# EAGLE design Board_Schamatic04 (EAGLE 9.6.2)
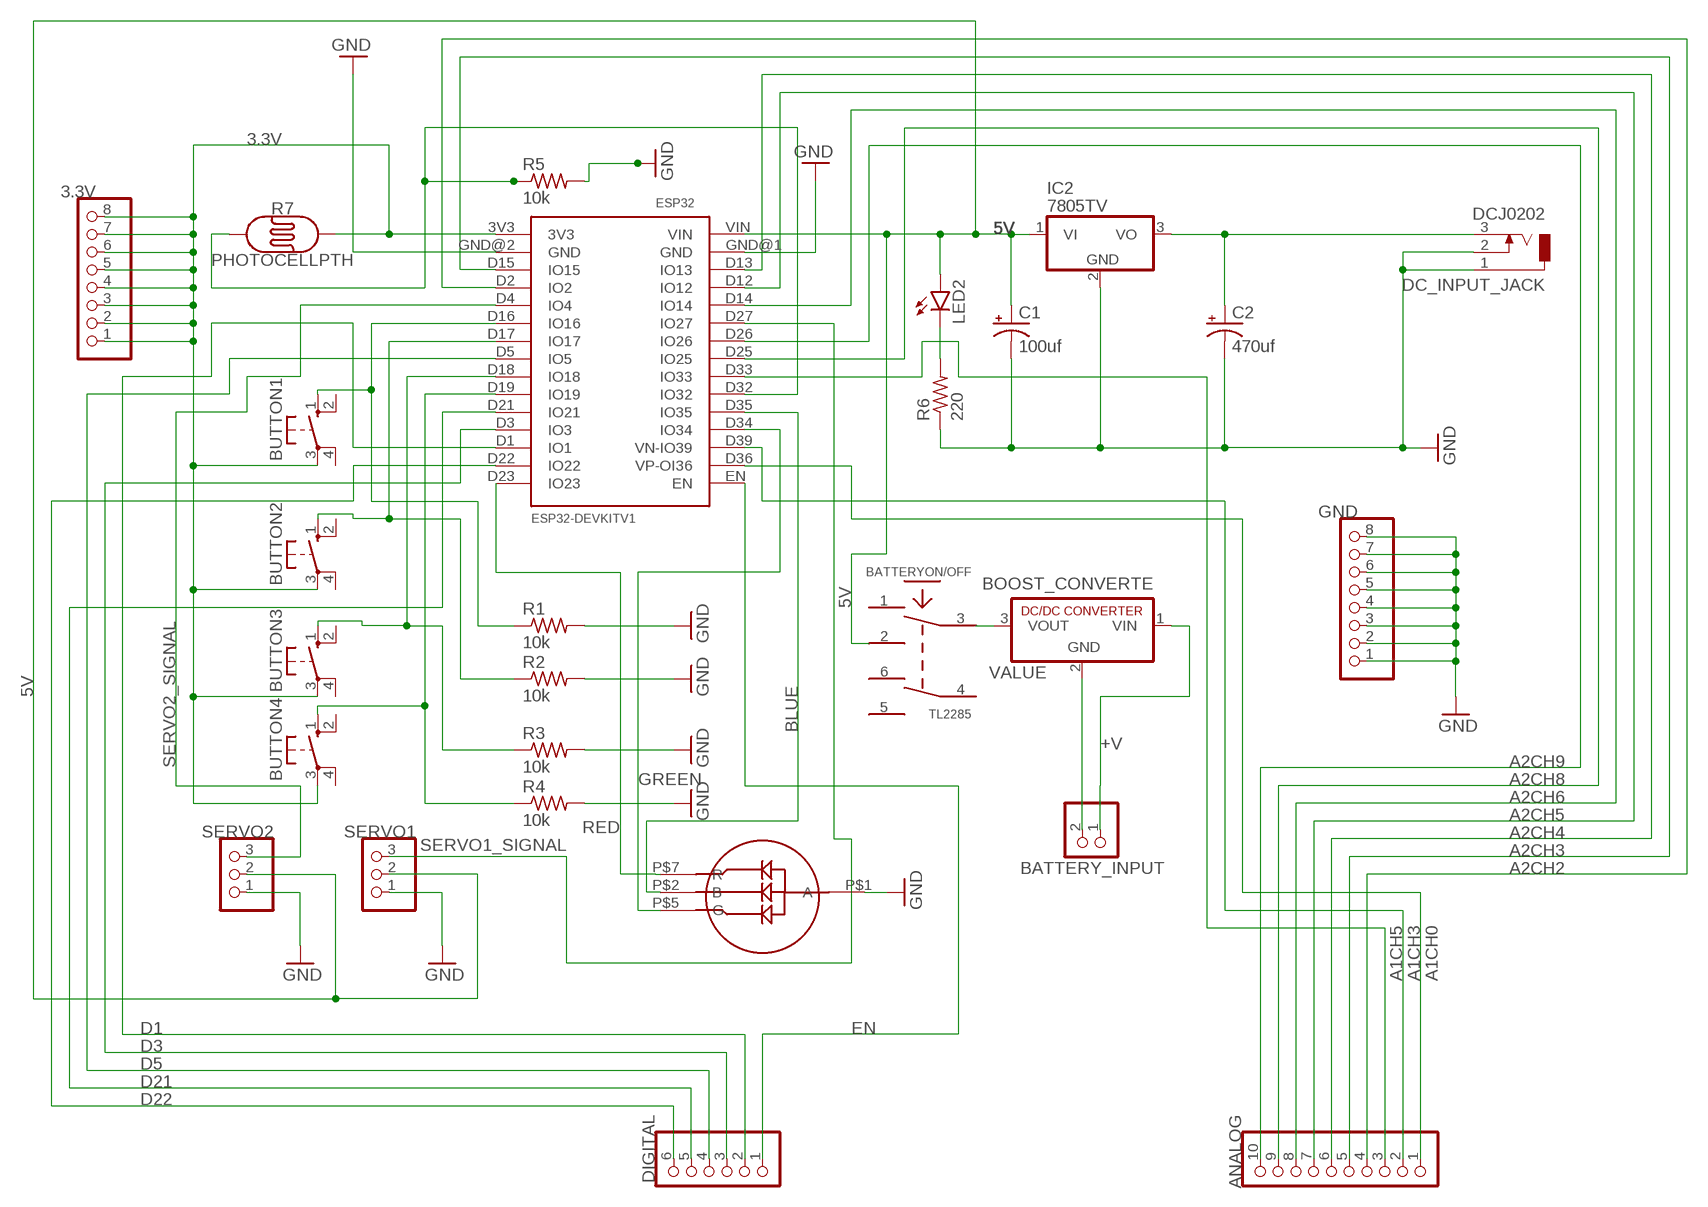
[diagram p0: schematic, sheet 1]

## Parts
3.3V  PINHD-1X8  [1X08]
ANALOG  PINHD-1X10  [1X10]
BATTERY_INPUT  PINHD-1X2  [1X02]
BATTERYON/OFF  TL2285  [TL2285_PCB]
BOOST_CONVERTE  R-78C1.8-1.0  [SIP3]
BUTTON1  10-XX  [B3F-10XX]
BUTTON2  10-XX  [B3F-10XX]
BUTTON3  10-XX  [B3F-10XX]
BUTTON4  10-XX  [B3F-10XX]
C1  100uf  CPOL-USE2-5  [E2-5]
C2  470uf  CPOL-USE2-5  [E2-5]
DC_INPUT_JACK  DCJ0202  [DCJ0202]
DIGITAL  PINHD-1X6  [1X06]
ESP32  ESP32DEVKITV1  [ESP32-DEVKITV1]
GND  PINHD-1X8  [1X08]
IC2  7805TV  [TO220V]
LED2  LED5MM  [LED5MM]
LED-4_PIN1  LED-4_PIN  [LED-4_PIN]
R1  10k  R-US_0207/10  [0207/10]
R2  10k  R-US_0207/10  [0207/10]
R3  10k  R-US_0207/10  [0207/10]
R4  10k  R-US_0207/10  [0207/10]
R5  10k  R-US_0207/10  [0207/10]
R6  220  R-US_0207/10  [0207/10]
R7  PHOTOCELLPTH  [PHOTOCELL]
SERVO1  PINHD-1X3  [1X03]
SERVO2  PINHD-1X3  [1X03]

## Nets
3.3V: 3.3V.1 3.3V.2 3.3V.3 3.3V.4 3.3V.5 3.3V.6 3.3V.7 3.3V.8 BUTTON1.3(P) BUTTON2.3(P) BUTTON3.3(P) BUTTON4.3(P) ESP32.3V3 R7.2
5V: BATTERYON/OFF.2 C1.+ ESP32.VIN IC2.1(VI) LED2.A SERVO1.2 SERVO2.2
+V: BATTERY_INPUT.1 BOOST_CONVERTE.1(VIN)
A1CH0: ANALOG.1 ESP32.D36(VP-OI36)
A1CH3: ANALOG.2 ESP32.D39(VN-IO39)
A1CH5: ANALOG.3 ESP32.D33(IO33)
A2CH2: ANALOG.4 ESP32.D2(IO2)
A2CH3: ANALOG.5 ESP32.D15(IO15)
A2CH4: ANALOG.6 ESP32.D13(IO13)
A2CH5: ANALOG.7 ESP32.D12(IO12)
A2CH6: ANALOG.8 ESP32.D14(IO14)
A2CH8: ANALOG.9 ESP32.D25(IO25)
A2CH9: ANALOG.10 ESP32.D26(IO26)
BLUE: ESP32.D35(IO35) LED-4_PIN1.P$2(B)
D1: DIGITAL.2 ESP32.D1(IO1)
D3: DIGITAL.3 ESP32.D3(IO3)
D5: DIGITAL.4 ESP32.D5(IO5)
D21: DIGITAL.5 ESP32.D21(IO21)
D22: DIGITAL.6 ESP32.D22(IO22)
EN: DIGITAL.1 ESP32.EN
GND: C1.- C2.- DC_INPUT_JACK.1 DC_INPUT_JACK.2 ESP32.GND@1(GND) ESP32.GND@2(GND) GND.1 GND.2 GND.3 GND.4 GND.5 GND.6 GND.7 GND.8 IC2.2(GND) LED-4_PIN1.P$1(A) R1.2 R2.2 R3.2 R4.2 R5.2 R6.1 SERVO1.1 SERVO2.1
GREEN: ESP32.D34(IO34) LED-4_PIN1.P$5(G)
N$1: BATTERYON/OFF.3 BOOST_CONVERTE.3(VOUT)
N$3: C2.+ DC_INPUT_JACK.3 IC2.3(VO)
N$4: LED2.K(C) R6.2
N$5: BATTERY_INPUT.2 BOOST_CONVERTE.2(GND)
N$9: ESP32.D32(IO32) R5.1 R7.1
N$10: BUTTON1.1(S) ESP32.D16(IO16) R1.1
N$11: BUTTON2.1(S) ESP32.D17(IO17) R2.1
N$12: BUTTON3.1(S) ESP32.D18(IO18) R3.1
N$13: BUTTON4.1(S) ESP32.D19(IO19) R4.1
RED: ESP32.D23(IO23) LED-4_PIN1.P$7(R)
SERVO1_SIGNAL: ESP32.D27(IO27) SERVO1.3
SERVO2_SIGNAL: ESP32.D4(IO4) SERVO2.3
Unconnected: BATTERYON/OFF.1 BATTERYON/OFF.4 BATTERYON/OFF.5 BATTERYON/OFF.6 BUTTON1.2(S1) BUTTON1.4(P1) BUTTON2.2(S1) BUTTON2.4(P1) BUTTON3.2(S1) BUTTON3.4(P1) BUTTON4.2(S1) BUTTON4.4(P1)

## Library data of the parts
3.3V GND = pinhead:PINHD-1X8: PIN HEADER
ANALOG = pinhead:PINHD-1X10: PIN HEADER
BATTERY_INPUT = pinhead:PINHD-1X2: PIN HEADER
BATTERYON/OFF = L71_devices:TL2285: E-Switch TL2285 (PCB switch)
BOOST_CONVERTE = dc-dc-converter:R-78C*-1.0: INNOLINE DC/DC-Converter 1.0 AMP SIP3 Single Output Source: Data sheet <http://www.mikrocontroller.net/attachment/150645/157764-da-01-en-DC_DC_WANDLER_R_78C5_0_1_0.pdf>
BUTTON1-BUTTON4 = switch-omron:10-XX: OMRON SWITCH; MPN: B3F-1000; OC_FARNELL: 176432; OC_NEWARK: 36M3542
C1 C2 = rcl:CPOL-US: POLARIZED CAPACITOR, American symbol; SPICEPREFIX: C
DC_INPUT_JACK = con-jack:DCJ0202: DC POWER JACK Source: DCJ0202.pdf; OC_FARNELL: unknown; OC_NEWARK: unknown
DIGITAL = pinhead:PINHD-1X6: PIN HEADER
ESP32 = ESP32-DEVKITV1:ESP32DEVKITV1
IC2 = linear:78*: Positive VOLTAGE REGULATOR Source: http://cache.national.com/ds/LM/LM78L05.pdf http://www.fairchildsemi.com/ds/LM/LM7805.pdf
LED2 = led:LED: LED OSRAM: - CHIPLED LG R971, LG N971, LY N971, LG Q971, LY Q971, LO R971, LY R971 LH N974, LH R974 LS Q976, LO Q976, LY Q976 LO Q996 - Hyper CHIPLED LW Q18S LB Q993, LB Q99A, LB R99A - SideLED LS A670, LO A670, LY A670, LG A670, LP A670 LB A673, LV A673, LT A673, LW A673 LH A674 LY A675 LS A676, LA A676, LO A676, LY A676, LW A676 LS A679, LY A679, LG A679 - Hyper Micro SIDELED® LS Y876, LA Y876, LO Y876, LY Y876 LT Y87S - SmartLED LW L88C, LW L88S LB L89C, LB L89S, LG L890 LS L89K, LO L89K, LY L89K LS L896, LA L896, LO L896, LY L896 - TOPLED LS T670, LO T670, LY T670, LG T670, LP T670 LSG T670, LSP T670, LSY T670, LOP T670, LYG T670 LG T671, LOG T671, LSG T671 LB T673, LV T673, LT T673, LW T673 LH T674 LS T676, LA T676, LO T676, LY T676, LB T676, LH T676, LSB T676, LW T676 LB T67C, LV T67C, LT T67C, LS T67K, LO T67K, LY T67K, LW E67C LS E67B, LA E67B, LO E67B, LY E67B, LB E67C, LV E67C, LT E67C LW T67C LS T679, LY T679, LG T679 LS T770, LO T770, LY T770, LG T770, LP T770 LB T773, LV T773, LT T773, LW T773 LH T774 LS E675, LA E675, LY E675, LS T675 LS T776, LA T776, LO T776, LY T776, LB T776 LHGB T686 LT T68C, LB T68C - Hyper Mini TOPLED® LB M676 - Mini TOPLED Santana® LG M470 LS M47K, LO M47K, LY M47K Source: http://www.osram.convergy.de LUXEON: - LUMILED® LXK2-PW12-R00, LXK2-PW12-S00, LXK2-PW14-U00, LXK2-PW14-V00 LXK2-PM12-R00, LXK2-PM12-S00, LXK2-PM14-U00 LXK2-PE12-Q00, LXK2-PE12-R00, LXK2-PE12-S00, LXK2-PE14-T00, LXK2-PE14-U00 LXK2-PB12-K00, LXK2-PB12-L00, LXK2-PB12-M00, LXK2-PB14-N00, LXK2-PB14-P00, LXK2-PB14-Q00 LXK2-PR12-L00, LXK2-PR12-M00, LXK2-PR14-Q00, LXK2-PR14-R00 LXK2-PD12-Q00, LXK2-PD12-R00, LXK2-PD12-S00 LXK2-PH12-R00, LXK2-PH12-S00 LXK2-PL12-P00, LXK2-PL12-Q00, LXK2-PL12-R00 Source: www.luxeon.com KINGBRIGHT: KA-3528ASYC Source: www.kingbright.com
LED-4_PIN1 = RGB-Led:LED-4_PIN
R1-R6 = rcl:R-US_: RESISTOR, American symbol; SPICEPREFIX: R
R7 = SparkFun-Sensors:PHOTOCELL: Photocell (Photodetector, Photo Resistor, CdS) This is a very small light sensor. A photocell changes (also called a photodetector, photo resistor, CdS or photoconductive cell) resistance depending on the amount of light it is exposed to. These little sensors make great ambient light triggers (when light in the room turns on, do something). Datasheet <http://cdn.sparkfun.com/datasheets/Sensors/LightImaging/SEN-09088.pdf> SparkFun Products Mini Photocell <https://www.sparkfun.com/products/9088> (SEN-09088); PROD_ID: COMP-09129; SF_ID: SEN-09088
SERVO1 SERVO2 = pinhead:PINHD-1X3: PIN HEADER

## Board
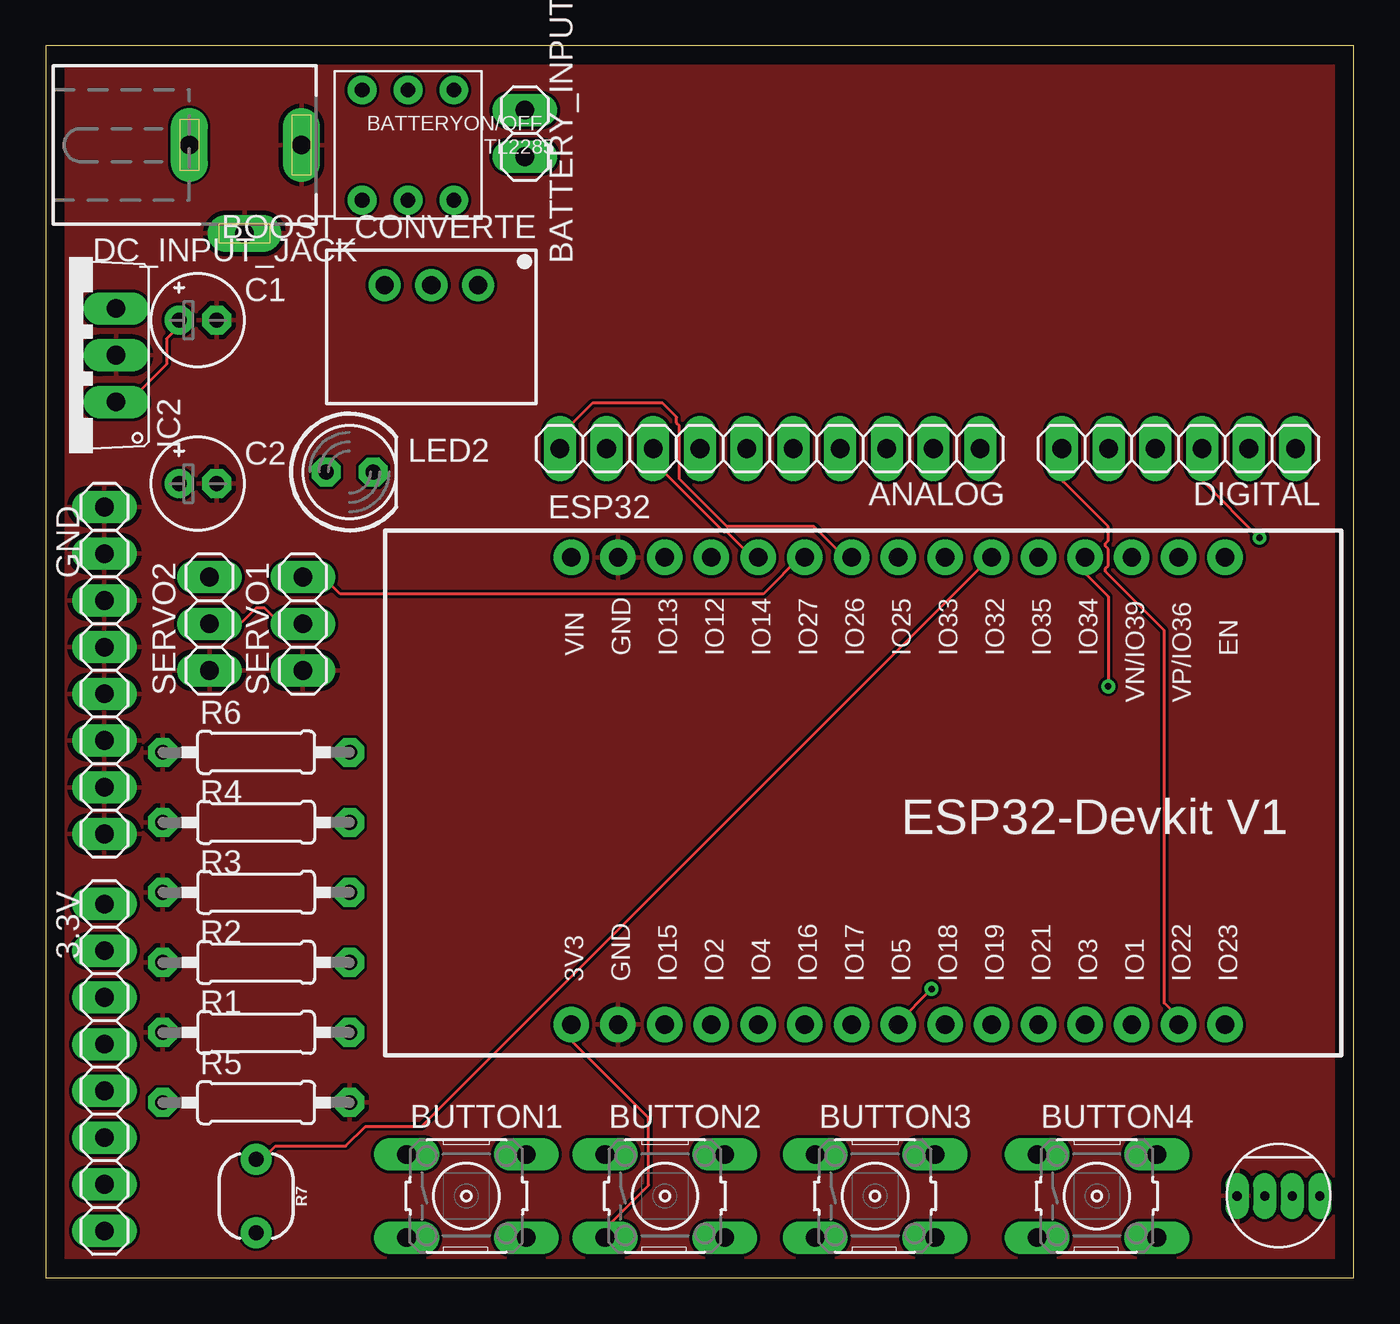
[diagram p1: board, top side]
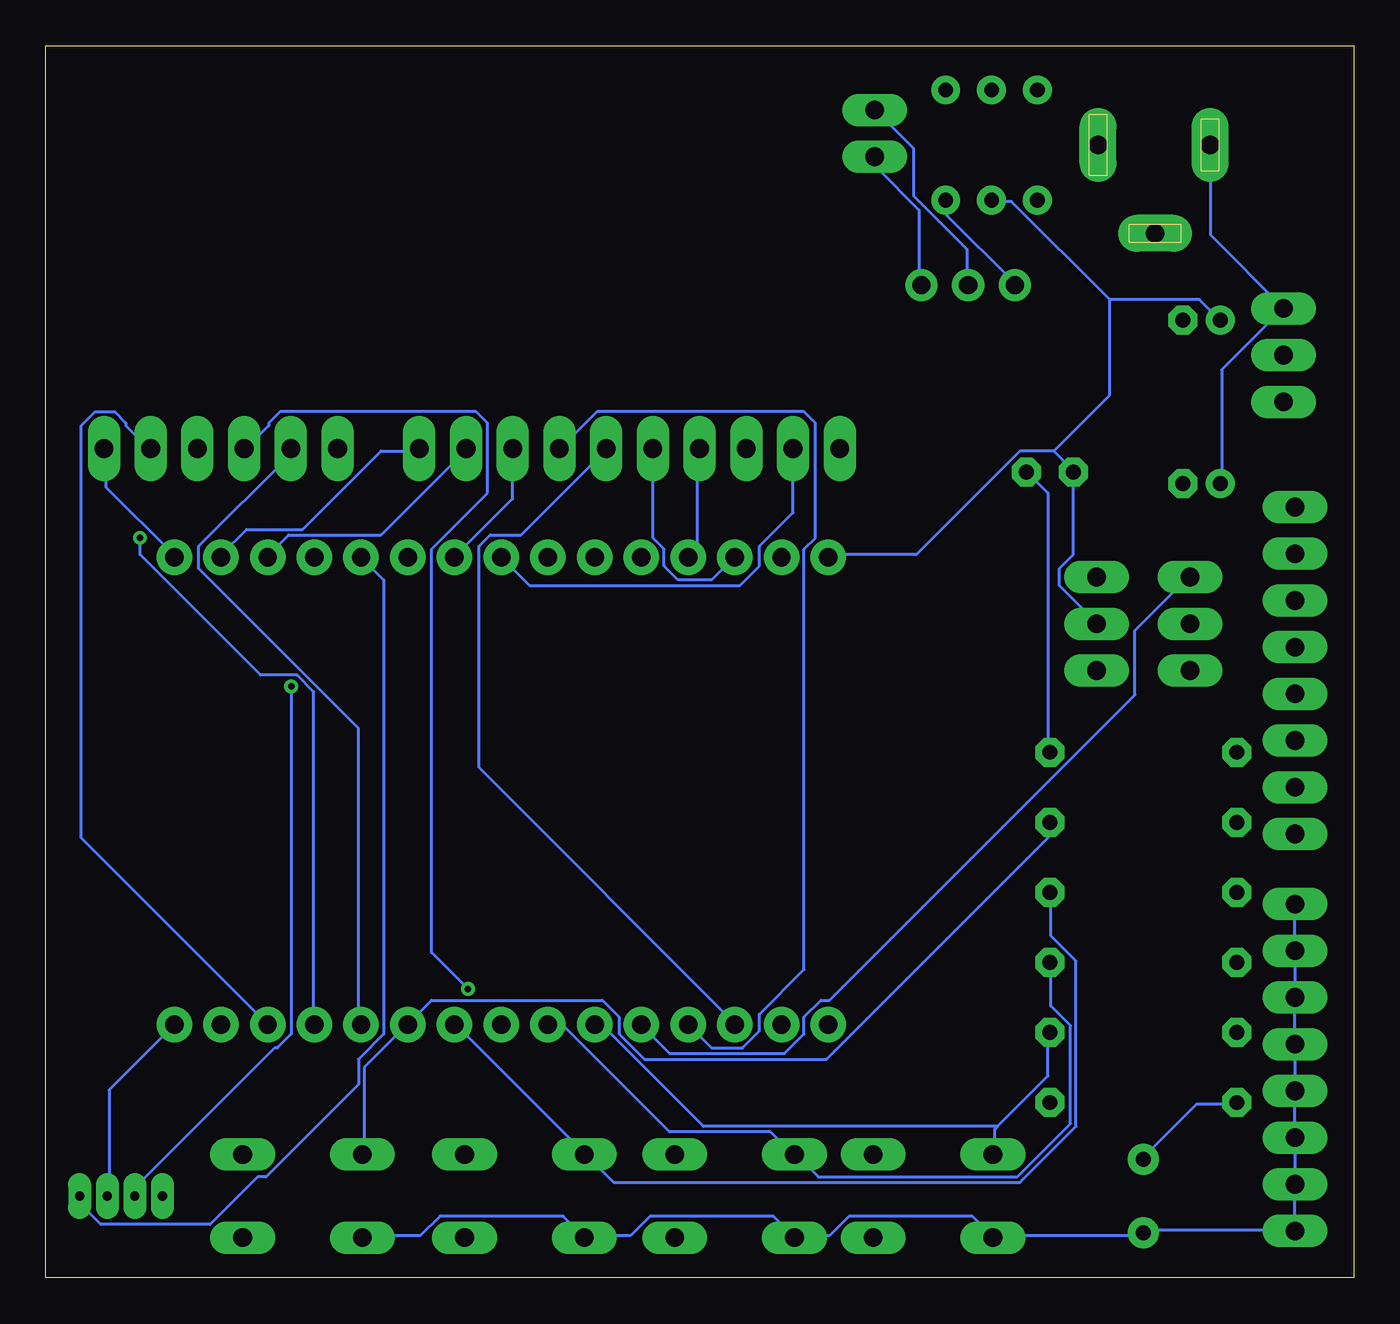
[diagram p2: board, bottom side, seen from below]

Size 71.1 x 66.98 mm. Coordinates in mm from the lower left corner, seen from the top.
Outline: 0,0 71.1,0 71.1,66.98 0,66.98 0,0
Copper layers (1*16): Top 0.035mm / dielectric 1.5mm / Bottom 0.035mm
Design rules "default *": minimum track width 6mil, minimum drill 0.35mm, track to track 6mil, track to pad 6mil, pad to pad 6mil, via to via 6mil, smd to smd 6mil, copper to edge 40mil, drill to drill 6mil, minimum pad ring 15mil, minimum via ring 8mil, stop-mask expansion 4mil, vias tented up to drill 0mil, thermal gap 10mil

### Footprints (pad centres in the part's own frame; a part is rotated, then mirrored left to right if it is on the bottom)
1X08 = drill 1.016 long: 1 -8.89,0; 2 -6.35,0; 3 -3.81,0; 4 -1.27,0; 5 1.27,0; 6 3.81,0; 7 6.35,0; 8 8.89,0
1X10 = drill 1.016 long: 1 -11.43,0; 2 -8.89,0; 3 -6.35,0; 4 -3.81,0; 5 -1.27,0; 6 1.27,0; 7 3.81,0; 8 6.35,0; 9 8.89,0; 10 11.43,0
1X02 = drill 1.016 long: 1 -1.27,0; 2 1.27,0
TL2285_PCB = drill 0.8: 1 -2.5,-3; 2 0,-3; 3 2.5,-3; 4 -2.5,3; 5 0,3; 6 2.5,3
SIP3 = drill 1 pad 1.676: 1 -2.54,0; 2 0,0; 3 2.54,0
B3F-10XX = drill 1.016 long: 1 -3.251,2.261; 2 3.251,2.261; 3 -3.251,-2.261; 4 3.251,-2.261
E2-5 = drill 0.813 pad 1.27: + -1.016,0 | drill 0.813 pad 1.27 octagon: - 1.016,0
DCJ0202 = drill 1 pad 2 long: 1 0,3.1; 2 4.8,0; 3 0,-3
1X06 = drill 1.016 long: 1 -6.35,0; 2 -3.81,0; 3 -1.27,0; 4 1.27,0; 5 3.81,0; 6 6.35,0
ESP32-DEVKITV1 = drill 1 pad 1.93: 3V3 -16.52,-12.27; D1 13.96,-12.27; D2 -8.9,-12.27; D3 11.42,-12.27; D4 -6.36,-12.27; D5 1.26,-12.27; D12 -8.9,13.135; D13 -11.44,13.135; D14 -6.36,13.135; D15 -11.44,-12.27; D16 -3.82,-12.27; D17 -1.28,-12.27; D18 3.8,-12.27; D19 6.34,-12.27; D21 8.88,-12.27; D22 16.5,-12.27; D23 19.04,-12.27; D25 1.26,13.135; D26 -1.28,13.135; D27 -3.82,13.135; D32 6.34,13.135; D33 3.8,13.135; D34 11.42,13.135; D35 8.88,13.135; D36 16.5,13.135; D39 13.96,13.135; EN 19.04,13.135; GND@1 -13.98,13.135; GND@2 -13.98,-12.27; VIN -16.52,13.135
TO220V = drill 1.016 long: 1 -2.54,-2.54; 2 0,-2.54; 3 2.54,-2.54
LED5MM = drill 0.813 octagon: A -1.27,0; K 1.27,0
LED-4_PIN = drill 0.5 long: P$1 0,0; P$2 0,4.5; P$5 0,1.5; P$7 0,3
0207/10 = drill 0.813 octagon: 1 -5.08,0; 2 5.08,0
PHOTOCELL = drill 0.8 pad 1.676: 1 -2,0; 2 2,0
1X03 = drill 1.016 long: 1 -2.54,0; 2 0,0; 3 2.54,0

### Placement (x,y rotation side)
3.3V  3.17,11.43 270 top
ANALOG  39.37,45.09 180 top
BATTERY_INPUT  26.04,62.23 90 top
BATTERYON/OFF  19.68,61.59 0 top
BOOST_CONVERTE  20.95,53.98 180 top
BUTTON1  22.86,4.45 0 top
BUTTON2  33.66,4.45 0 top
BUTTON3  45.09,4.45 0 top
BUTTON4  57.15,4.45 0 top
C1  8.26,52.07 0 top
C2  8.26,43.18 0 top
DC_INPUT_JACK  10.79,61.59 270 top
DIGITAL  61.59,45.09 180 top
ESP32  45.09,26.04 0 top
GND  3.17,33.02 270 top
IC2  1.27,50.16 90 top
LED2  16.51,43.81 0 top
LED-4_PIN1  64.77,4.45 270 top
R1  11.43,13.34 180 top
R2  11.43,17.14 180 top
R3  11.43,20.95 180 top
R4  11.43,24.77 180 top
R5  11.43,9.53 0 top
R6  11.43,28.57 0 top
R7  11.43,4.45 270 top
SERVO1  13.97,35.56 90 top
SERVO2  8.89,35.56 90 top

### Tracks (layer width: path | path; a pad name or v marks a point on that pad's centre or on a via)
3.3V
  Top 0.152: ESP32.3V3 28.65,13.72 28.65,12.8 32.77,8.69 32.77,5.03 30.48,2.74 30.48,2.29 BUTTON2.3
  Bottom 0.152: 3.2,15.24 3.2,17.68 3.3V.2 3.2,17.83 3.2,20.27 3.3V.1 | 3.2,7.62 3.2,5.18 3.3V.7 3.2,5.03 3.2,2.59 | 3.2,2.59 11.43,2.59 R7.2 11.43,2.44 11.58,2.29 19.51,2.29 BUTTON1.3 19.66,2.29 20.73,3.35 27.43,3.35 28.5,2.29 30.33,2.29 BUTTON2.3 30.48,2.29 31.55,3.35 38.25,3.35 39.32,2.29 41.76,2.29 BUTTON3.3 41.91,2.29 42.98,3.35 49.68,3.35 50.75,2.29 53.8,2.29 BUTTON4.3 | 3.2,2.59 3.3V.8 | 3.2,7.62 3.2,10.06 3.3V.5 3.2,10.21 3.2,12.65 3.3V.4 3.2,12.8 3.2,15.24 | 3.2,7.62 3.3V.6 | 3.2,15.24 3.3V.3
5V
  Top 0.152: IC2.1 3.81,47.7 4.57,47.7 6.55,49.68 6.55,51.05 7.16,51.66 7.16,51.97 C1.+ | SERVO2.2 8.99,35.66 10.67,35.66 11.43,36.42 11.89,36.42 12.65,35.66 13.87,35.66 SERVO1.2
  Bottom 0.152: 13.26,53.19 18.59,58.52 19.66,58.52 BATTERYON/OFF.2 | 13.26,53.19 8.38,53.19 7.32,52.12 C1.+ | SERVO1.2 14.02,35.66 16,37.64 16,38.56 15.24,39.32 LED2.A 15.24,43.89 16.31,44.96 | 16.31,44.96 18.14,44.96 23.77,39.32 28.5,39.32 ESP32.VIN | 13.26,53.19 13.26,48.01 16.31,44.96
+V
  Bottom 0.152: BOOST_CONVERTE.1 23.62,54.1 23.62,58.06 25.91,60.35 25.91,60.96 BATTERY_INPUT.1
A1CH0
  Bottom 0.152: ANALOG.1 50.9,44.96 52.88,44.96 57.15,40.69 60.2,40.69 61.57,39.32 ESP32.D36
A1CH3
  Bottom 0.152: ANALOG.2 48.31,44.96 52.88,40.39 57.91,40.39 58.98,39.32 ESP32.D39
A1CH5
  Bottom 0.152: ANALOG.3 45.72,42.37 48.77,39.32 ESP32.D33
A2CH2
  Bottom 0.152: ANALOG.4 43.13,45.11 41.15,47.09 29.87,47.09 29.26,46.48 29.26,40.23 29.87,39.62 29.87,16.76 32.31,14.33 32.31,13.41 33.22,12.5 34.9,12.5 36.12,13.72 ESP32.D2
A2CH3
  Bottom 0.152: ANALOG.5 40.69,44.96 45.26,40.39 46.94,40.39 47.55,39.78 47.55,27.74 33.68,13.87 ESP32.D15
A2CH4
  Bottom 0.152: ANALOG.6 38.1,40.23 37.49,39.62 37.49,38.71 36.73,37.95 34.9,37.95 33.68,39.17 ESP32.D13
A2CH5
  Bottom 0.152: ANALOG.7 35.66,44.96 35.66,39.78 36.12,39.32 ESP32.D12
A2CH6
  Top 0.152: ANALOG.8 33.07,44.96 33.07,44.35 36.88,40.54 37.03,40.54 38.25,39.32 38.71,39.32 ESP32.D14
A2CH8
  Bottom 0.152: ANALOG.9 30.48,41.6 32.31,39.78 32.31,38.71 33.38,37.64 44.81,37.64 ESP32.D25
A2CH9
  Top 0.152: ANALOG.10 28.04,45.11 28.04,45.87 29.72,47.55 33.53,47.55 34.29,46.79 34.29,46.48 34.44,46.33 34.44,43.43 37.03,40.84 41.76,40.84 43.28,39.32 43.74,39.32 ESP32.D26
BLUE
  Bottom 0.152: LED-4_PIN1.P$2 69.19,4.42 69.19,3.96 68.12,2.9 62.18,2.9 59.59,5.49 59.13,5.49 54.1,10.52 54.1,11.89 52.73,13.26 52.73,37.95 53.95,39.17 ESP32.D35
D1
  Bottom 0.152: DIGITAL.2 65.53,45.11 66.75,46.33 66.75,46.48 67.36,47.09 68.43,47.09 69.19,46.33 69.19,23.93 59.13,13.87 ESP32.D1
D3  (via drill 0.35)
  Top 0.152: v65.99,40.23 62.94,43.28 62.94,44.96 DIGITAL.3
  Bottom 0.152: v65.99,40.23 65.99,39.32 59.44,32.77 57.45,32.77 56.54,31.85 56.54,13.87 ESP32.D3
D5  (via drill 0.35)
  Top 0.152: v48.16,15.7 46.33,13.87 ESP32.D5
  Bottom 0.152: v48.16,15.7 50.14,17.68 50.14,39.62 47.09,42.67 47.09,46.48 47.7,47.09 58.37,47.09 58.98,46.48 58.98,46.33 60.2,45.11 DIGITAL.4
D21
  Bottom 0.152: DIGITAL.5 57.91,44.96 57.91,44.65 62.79,39.78 62.79,38.56 54.1,29.87 54.1,13.87 ESP32.D21
D22
  Top 0.152: DIGITAL.6 55.32,44.96 55.32,43.28 57.76,40.84 57.76,40.08 57.61,39.93 57.61,39.78 57.76,39.62 57.76,38.71 57.61,38.56 57.61,38.41 60.81,35.2 60.81,14.94 61.57,14.17 61.57,13.87 ESP32.D22
EN
  Bottom 0.152: DIGITAL.1 67.82,44.96 67.82,42.98 64.16,39.32 ESP32.EN
GND
  pour Top: 0,67.31 0,0 71.12,0 71.12,67.31
GREEN  (via drill 0.35)
  Top 0.152: v57.76,32.16 57.76,37.03 56.54,38.25 56.54,39.17 ESP32.D34
  Bottom 0.152: v57.76,32.16 57.76,13.26 58.52,12.5 58.67,12.5 66.14,5.03 66.14,4.57 LED-4_PIN1.P$5
N$1
  Bottom 0.152: BATTERYON/OFF.3 22.1,58.52 22.1,57.76 18.44,54.1 BOOST_CONVERTE.3
N$3
  Bottom 0.152: 3.81,52.73 7.16,49.38 7.16,43.28 C2.+ | 3.81,52.73 7.77,56.69 7.77,61.57 DC_INPUT_JACK.3 | 3.81,52.73 IC2.3
N$4
  Bottom 0.152: R6.2 16.61,28.65 16.61,42.67 17.68,43.74 LED2.K
N$5
  Bottom 0.152: BOOST_CONVERTE.2 21.03,54.1 21.03,55.93 23.93,58.83 23.93,61.42 25.91,63.4 BATTERY_INPUT.2
N$9
  Top 0.152: ESP32.D32 51.36,39.17 20.42,8.23 17.37,8.23 16.31,7.16 12.5,7.16 11.89,6.55 11.43,6.55 R7.1
  Bottom 0.152: R5.1 6.4,9.45 8.53,9.45 11.43,6.55 R7.1
N$10
  Bottom 0.152: 19.36,8.23 19.51,8.08 19.51,6.71 BUTTON1.1 | 19.36,8.23 16.61,10.97 16.61,13.26 R1.1 | 19.36,8.23 35.36,8.23 40.84,13.72 41.15,13.72 ESP32.D16
N$11
  Bottom 0.152: R2.1 16.46,17.07 16.46,14.78 15.39,13.72 15.39,8.38 18.29,5.49 29.11,5.49 30.33,6.71 BUTTON2.1 30.48,6.71 31.7,7.92 37.19,7.92 42.98,13.72 43.74,13.72 ESP32.D17
N$12
  Bottom 0.152: 41.76,6.71 40.23,5.18 18.14,5.18 15.09,8.23 15.09,17.22 16.46,18.59 16.46,20.88 R3.1 | 41.76,6.71 48.77,13.72 ESP32.D18 | 41.76,6.71 BUTTON3.1
N$13
  Bottom 0.152: R4.1 16.61,24.69 16.61,23.93 28.65,11.89 38.56,11.89 39.93,13.26 39.93,14.17 40.84,15.09 50.14,15.09 51.36,13.87 ESP32.D19 51.51,13.72 53.8,11.43 53.8,6.71 BUTTON4.1
RED
  Bottom 0.152: LED-4_PIN1.P$7 67.67,4.57 67.67,10.21 64.16,13.72 ESP32.D23
SERVO1_SIGNAL
  Top 0.152: SERVO1.3 15.09,38.1 16,37.19 39.01,37.19 41.15,39.32 ESP32.D27
SERVO2_SIGNAL
  Bottom 0.152: SERVO2.3 8.99,38.1 11.89,35.2 11.89,31.7 28.5,15.09 28.96,15.09 29.87,14.17 29.87,13.26 30.94,12.19 37.19,12.19 38.71,13.72 ESP32.D4